# EAGLE design BOT_Input_board_adi (EAGLE 9.6.2)
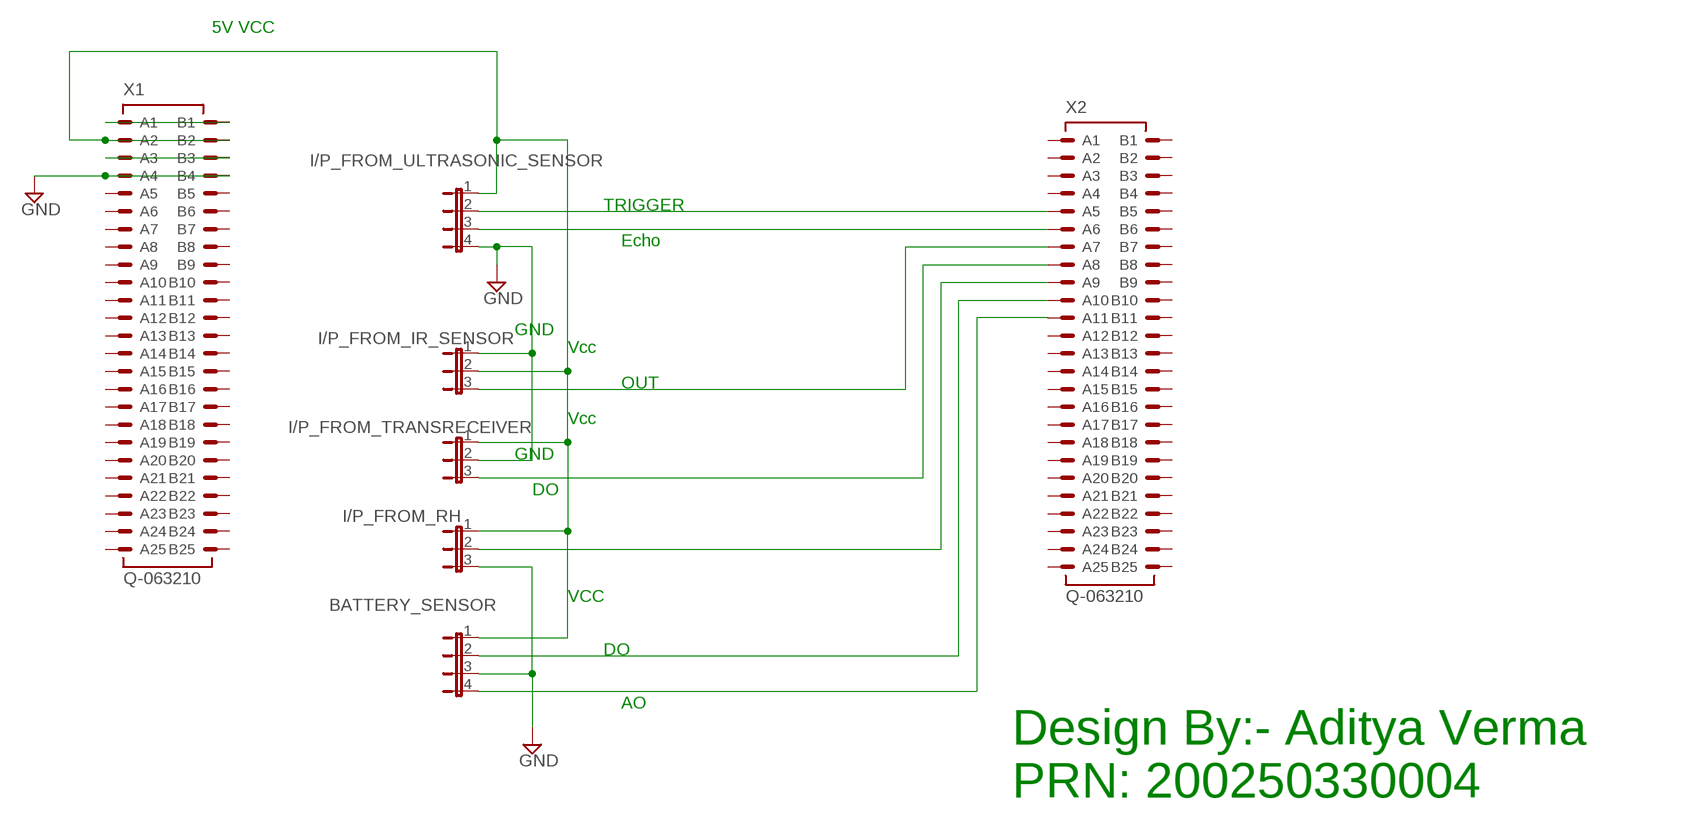
[diagram p0: schematic, sheet 1]

## Parts
BATTERY_SENSOR  JP4E  [JP4]
I/P_FROM_IR_SENSOR  JP2E  [JP2]
I/P_FROM_RH  JP2E  [JP2]
I/P_FROM_TRANSRECEIVER  JP2E  [JP2]
I/P_FROM_ULTRASONIC_SENSOR  JP4E  [JP4]
X1  Q-063210  [063210]
X2  Q-063210  [063210]

## Nets
GND: BATTERY_SENSOR.3 I/P_FROM_IR_SENSOR.1 I/P_FROM_RH.3 I/P_FROM_TRANSRECEIVER.2 I/P_FROM_ULTRASONIC_SENSOR.4 X1.A4 X1.B4
N$1: I/P_FROM_ULTRASONIC_SENSOR.3 X2.A6
N$2: X1.A1 X1.B1
N$3: BATTERY_SENSOR.1 I/P_FROM_IR_SENSOR.2 I/P_FROM_RH.1 I/P_FROM_TRANSRECEIVER.1 I/P_FROM_ULTRASONIC_SENSOR.1 X1.A2 X1.B2
N$4: X1.A3 X1.B3
N$5: I/P_FROM_ULTRASONIC_SENSOR.2 X2.A5
N$6: I/P_FROM_IR_SENSOR.3 X2.A7
N$7: I/P_FROM_TRANSRECEIVER.3 X2.A8
N$8: I/P_FROM_RH.2 X2.A9
N$10: BATTERY_SENSOR.2 X2.A10
N$12: BATTERY_SENSOR.4 X2.A11
Unconnected: X1.A5 X1.A6 X1.A7 X1.A8 X1.A9 X1.A10 X1.A11 X1.A12 X1.A13 X1.A14 X1.A15 X1.A16 X1.A17 X1.A18 X1.A19 X1.A20 X1.A21 X1.A22 X1.A23 X1.A24 X1.A25 X1.B5 X1.B6 X1.B7 X1.B8 X1.B9 X1.B10 X1.B11 X1.B12 X1.B13 X1.B14 X1.B15 X1.B16 X1.B17 X1.B18 X1.B19 X1.B20 X1.B21 X1.B22 X1.B23 X1.B24 X1.B25 X2.A1 X2.A2 X2.A3 X2.A4 X2.A12 X2.A13 X2.A14 X2.A15 X2.A16 X2.A17 X2.A18 X2.A19 X2.A20 X2.A21 X2.A22 X2.A23 X2.A24 X2.A25 X2.B1 X2.B2 X2.B3 X2.B4 X2.B5 X2.B6 X2.B7 X2.B8 X2.B9 X2.B10 X2.B11 X2.B12 X2.B13 X2.B14 X2.B15 X2.B16 X2.B17 X2.B18 X2.B19 X2.B20 X2.B21 X2.B22 X2.B23 X2.B24 X2.B25

## Notes on the sheet
- 5V VCC
- TRIGGER
- Echo
- GND
- Vcc
- OUT
- Vcc
- GND
- DO
- VCC
- DO
- AO
- Design By:- Aditya Verma
  PRN: 200250330004

## Library data of the parts
BATTERY_SENSOR I/P_FROM_ULTRASONIC_SENSOR = jumper:JP4E: JUMPER
I/P_FROM_IR_SENSOR I/P_FROM_RH I/P_FROM_TRANSRECEIVER = jumper:JP2E: JUMPER
X1 X2 = con-erni:Q-063210: Male Connector SMC-Q 50 contacts Standard Assembly Height Source: http://www.erni.com/DB/PDF-Drawing/SMC/063210.pdf; OC_FARNELL: unknown; OC_NEWARK: unknown

## Board
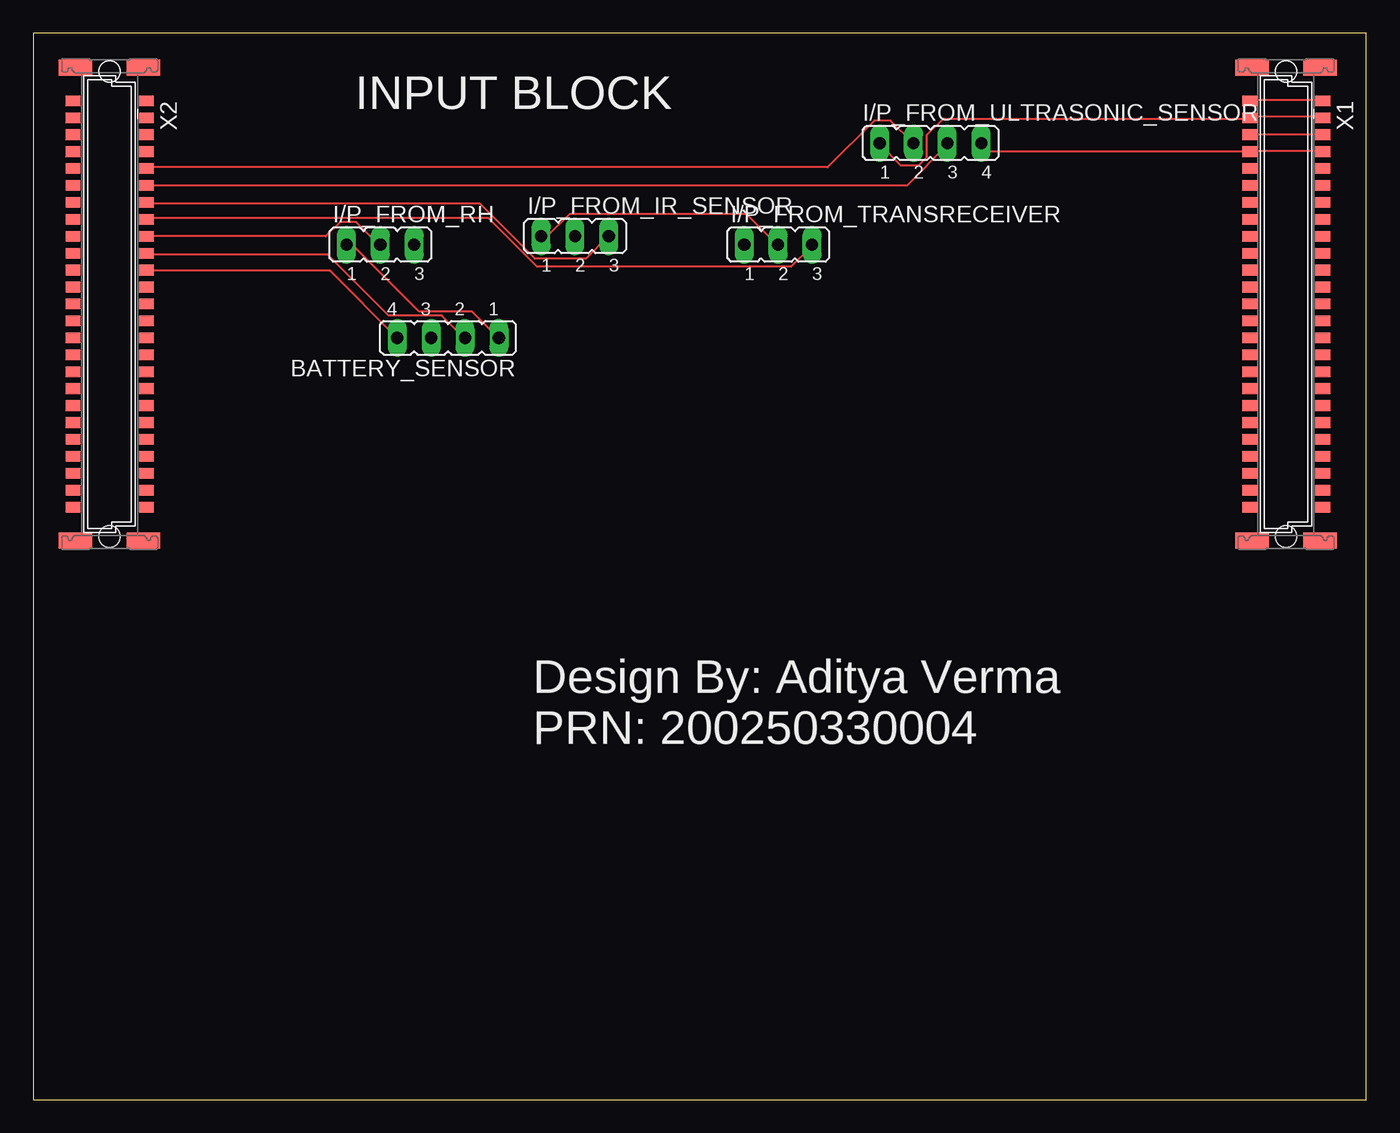
[diagram p1: board, top side]
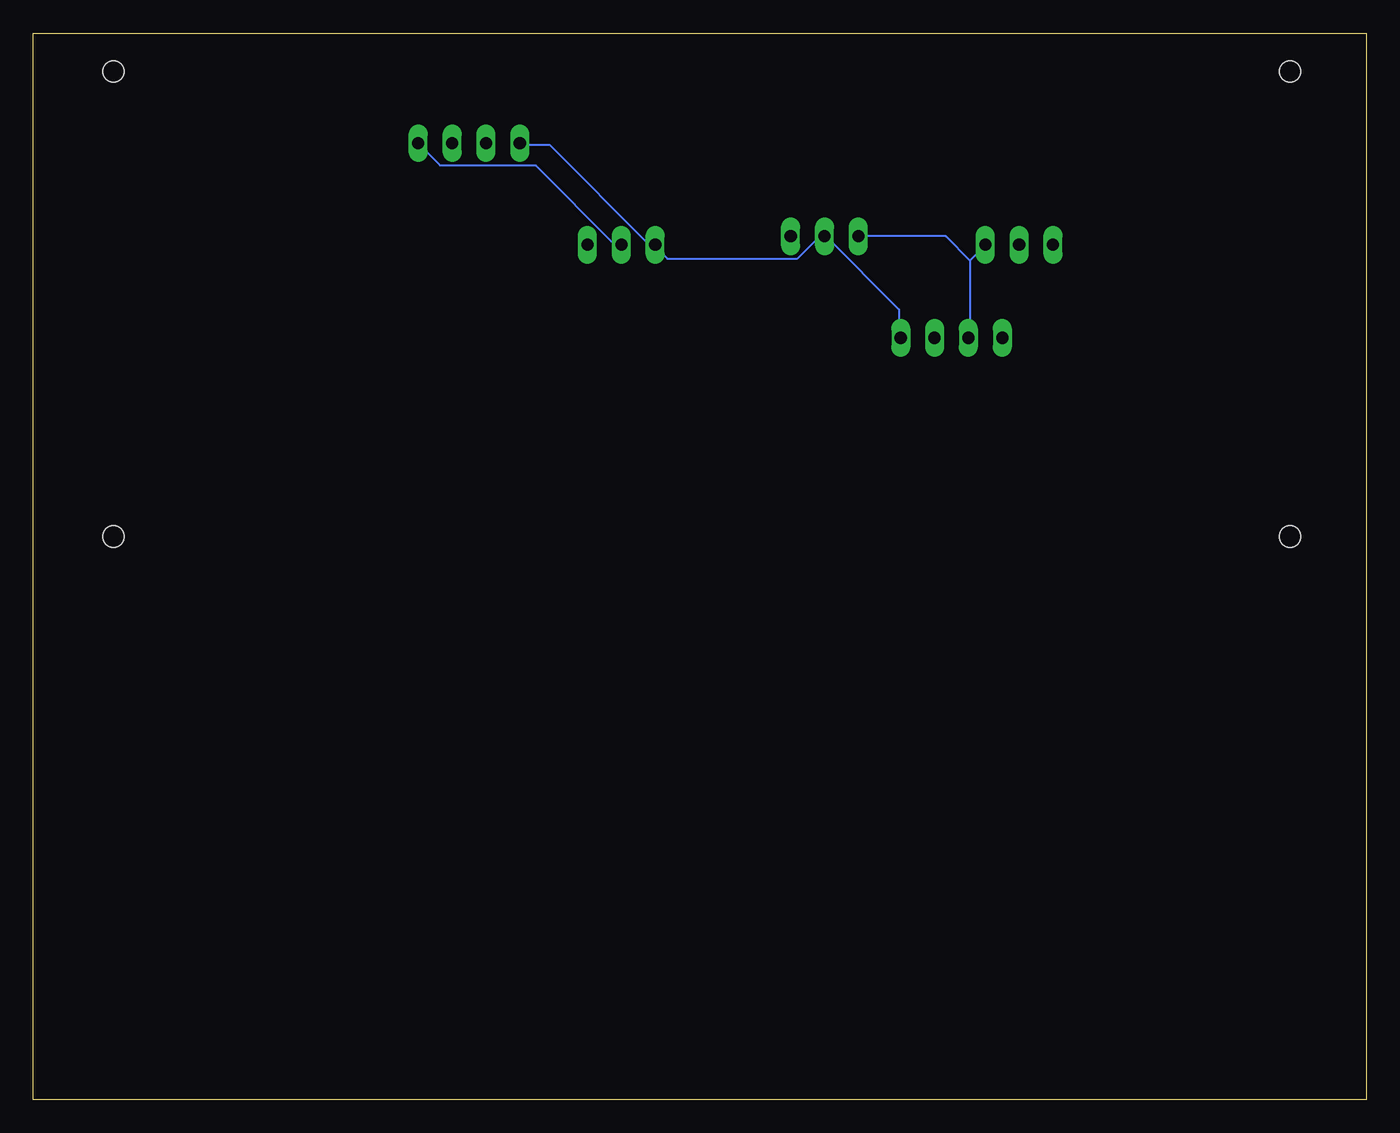
[diagram p2: board, bottom side, seen from below]

Size 100 x 80 mm. Coordinates in mm from the lower left corner, seen from the top.
Outline: 0,0 100,0 100,80 0,80 0,0
Copper layers (1*16): Top 0.035mm / dielectric 1.5mm / Bottom 0.035mm
Design rules "default": minimum track width 6mil, minimum drill 0.35mm, track to track 6mil, track to pad 6mil, pad to pad 6mil, via to via 6mil, smd to smd 6mil, copper to edge 40mil, drill to drill 6mil, minimum pad ring 10mil, minimum via ring 8mil, stop-mask expansion 4mil, vias tented up to drill 0mil, thermal gap 10mil

### Footprints (pad centres in the part's own frame; a part is rotated, then mirrored left to right if it is on the bottom)
JP4 = drill 0.914 long: 1 -3.81,0; 2 -1.27,0; 3 1.27,0; 4 3.81,0
JP2 = drill 0.914 long: 1 -2.54,0; 2 0,0; 3 2.54,0
063210 = smd 0.8 x 1.1: A1 -15.24,2.765; A2 -13.97,2.765; A3 -12.7,2.765; A4 -11.43,2.765; A5 -10.16,2.765; A6 -8.89,2.765; A7 -7.62,2.765; A8 -6.35,2.765; A9 -5.08,2.765; A10 -3.81,2.765; A11 -2.54,2.765; A12 -1.27,2.765; A13 0,2.765; A14 1.27,2.765; A15 2.54,2.765; A16 3.81,2.765; A17 5.08,2.765; A18 6.35,2.765; A19 7.62,2.765; A20 8.89,2.765; A21 10.16,2.765; A22 11.43,2.765; A23 12.7,2.765; A24 13.97,2.765; A25 15.24,2.765; B1 -15.24,-2.74; B2 -13.97,-2.74; B3 -12.7,-2.74; B4 -11.43,-2.74; B5 -10.16,-2.74; B6 -8.89,-2.74; B7 -7.62,-2.74; B8 -6.35,-2.74; B9 -5.08,-2.74; B10 -3.81,-2.74; B11 -2.54,-2.74; B12 -1.27,-2.74; B13 0,-2.74; B14 1.27,-2.74; B15 2.54,-2.74; B16 3.81,-2.74; B17 5.08,-2.74; B18 6.35,-2.74; B19 7.62,-2.74; B20 8.89,-2.74; B21 10.16,-2.74; B22 11.43,-2.74; B23 12.7,-2.74; B24 13.97,-2.74; B25 15.24,-2.74 | smd 1.2 x 2.5: M1 -17.745,2.55; M2 -17.745,-2.55; M3 17.745,-2.55; M4 17.745,2.55 | hole 1.6: -17.45,0; 17.45,0

### Placement (x,y rotation side)
BATTERY_SENSOR  31.11,57.15 180 top
I/P_FROM_IR_SENSOR  40.64,64.77 0 top
I/P_FROM_RH  26.04,64.14 0 top
I/P_FROM_TRANSRECEIVER  55.88,64.14 0 top
I/P_FROM_ULTRASONIC_SENSOR  67.31,71.75 0 top
X1  93.98,59.69 270 top
X2  5.71,59.69 270 top

### Tracks (layer width: path | path; a pad name or v marks a point on that pad's centre or on a via)
GND
  Top 0.152: X1.A4 96.62,71.17 91.29,71.17 X1.B4 91.14,71.17 71.63,71.17 71.17,71.63 I/P_FROM_ULTRASONIC_SENSOR.4 | I/P_FROM_IR_SENSOR.1 38.56,64.77 40.23,66.45 53.49,66.45 55.78,64.16 I/P_FROM_TRANSRECEIVER.2
  Bottom 0.152: 29.72,62.94 29.72,57.15 BATTERY_SENSOR.3 | 29.72,62.94 28.65,64.01 I/P_FROM_RH.3 | I/P_FROM_IR_SENSOR.1 31.55,64.77 29.72,62.94 | I/P_FROM_TRANSRECEIVER.2 55.93,64.16 56.39,64.16 62.33,70.1 69.49,70.1 71.02,71.63 I/P_FROM_ULTRASONIC_SENSOR.4
N$1
  Top 0.152: X2.A6 65.53,68.58 68.58,71.63 I/P_FROM_ULTRASONIC_SENSOR.3
N$2
  Top 0.152: X1.B1 91.29,74.98 96.62,74.98 X1.A1
N$3
  Top 0.152: I/P_FROM_RH.1 23.62,64.01 24.08,64.01 28.96,59.13 32.92,59.13 34.9,57.15 BATTERY_SENSOR.1 | X1.A2 96.62,73.76 91.29,73.76 X1.B2 91.14,73.61 68.28,73.61 67.06,72.39 67.06,70.71 66.45,70.1 65.08,70.1 63.55,71.63 I/P_FROM_ULTRASONIC_SENSOR.1
  Bottom 0.152: BATTERY_SENSOR.1 35.05,57.15 35.05,59.28 40.54,64.77 I/P_FROM_IR_SENSOR.2 41,64.77 42.67,63.09 52.43,63.09 53.34,64.01 I/P_FROM_TRANSRECEIVER.1 53.34,64.16 53.8,64.16 61.27,71.63 63.4,71.63 I/P_FROM_ULTRASONIC_SENSOR.1
N$4
  Top 0.152: X1.A3 X1.B3
N$5
  Top 0.152: X2.A5 8.53,69.95 59.59,69.95 63.09,73.46 64.31,73.46 65.99,71.78 I/P_FROM_ULTRASONIC_SENSOR.2
N$6
  Top 0.152: X2.A7 8.53,67.21 33.53,67.21 37.64,63.09 41.45,63.09 43.13,64.77 I/P_FROM_IR_SENSOR.3
N$7
  Top 0.152: X2.A8 8.53,66.14 34.14,66.14 37.8,62.48 56.84,62.48 58.37,64.01 I/P_FROM_TRANSRECEIVER.3
N$8
  Top 0.152: X2.A9 21.95,64.77 23.01,65.84 24.23,65.84 25.91,64.16 I/P_FROM_RH.2
N$10
  Top 0.152: X2.A10 8.53,63.4 22.1,63.4 26.67,58.83 30.63,58.83 32.31,57.15 BATTERY_SENSOR.2
N$12
  Top 0.152: X2.A11 8.53,62.18 22.25,62.18 27.28,57.15 BATTERY_SENSOR.4

### Text on the board
tPlace: INPUT BLOCK | Design By: Aditya Verma / PRN: 200250330004